# EAGLE design Moisture_8266 (EAGLE 6.6.0)
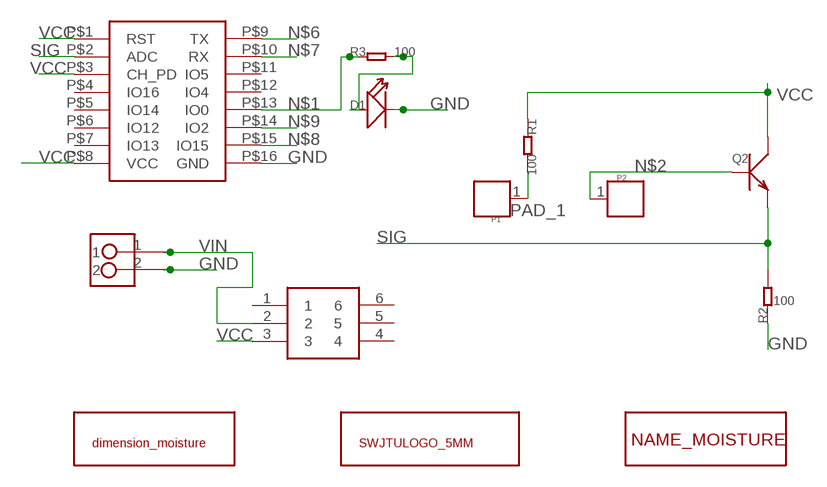
[diagram p0: schematic, sheet 1]

## Parts
D1  LED0603  [LED-0603]
P1  PAD.03  [1P-SMD-0.76X0.76]
P2  PAD.03  [1P-SMD-0.76X0.76]
Q2  TRANSISTOR-NPN-SOT23''  [SOT23]
R1  100  R-0603  [0603]
R2  100  R-0603  [0603]
R3  100  R-0603  [R0603]
U$1  MSS-22C02  [MSS-22C02]
U$2  SWJTULOGO  [SWJTULOGO10*10MM]
U$4  NAME_MOISTURE  [NAME_MOISTURE]
U$5  HEAD_8266_07  [HEAD_8266_07]
U$6  POWER_3.6V  [POWER_3.6V]
U$7  DIMENSION_MOISTURE_LONG  [MOISTURE_LONG]

## Nets
GND: D1.- R2.1 U$5.P$16(GND) U$6.2
N$1: R3.1 U$5.P$13(IO0)
N$2: P2.1 Q2.1(B)
N$6: U$5.P$9(TX)
N$7: U$5.P$10(RX)
N$8: U$5.P$15(IO15)
N$9: U$5.P$14(IO2)
N$10: D1.+ R3.2
PAD_1: P1.1 R1.2
SIG: Q2.2(E) R2.2 U$5.P$2(ADC)
VCC: Q2.3(C) R1.1 U$1.3 U$5.P$1(RST) U$5.P$3(CH_PD) U$5.P$8(VCC)
VIN: U$1.2 U$6.1
Unconnected: U$1.1 U$1.4 U$1.5 U$1.6 U$5.P$4(IO16) U$5.P$5(IO14) U$5.P$6(IO12) U$5.P$7(IO13) U$5.P$11(IO5) U$5.P$12(IO4)

## Library data of the parts
D1 = Xmaker:LED*
P1 P2 = Discrete:PAD
Q2 = Discrete:TRANSISTOR-NPN*: NPN audion
R1 R2 = Discrete:R*
R3 = Xmaker:R*
U$1 = Xmaker:MSS-22C02
U$2 = Xmaker:SWJTULOGO
U$4 = Xmaker:NAME_MOISTURE
U$5 = Xmaker:HEAD_8266_07
U$6 = Xmaker:POWER_3.6V
U$7 = Xmaker:DIMENSION_MOISTURE_LONG

## Board
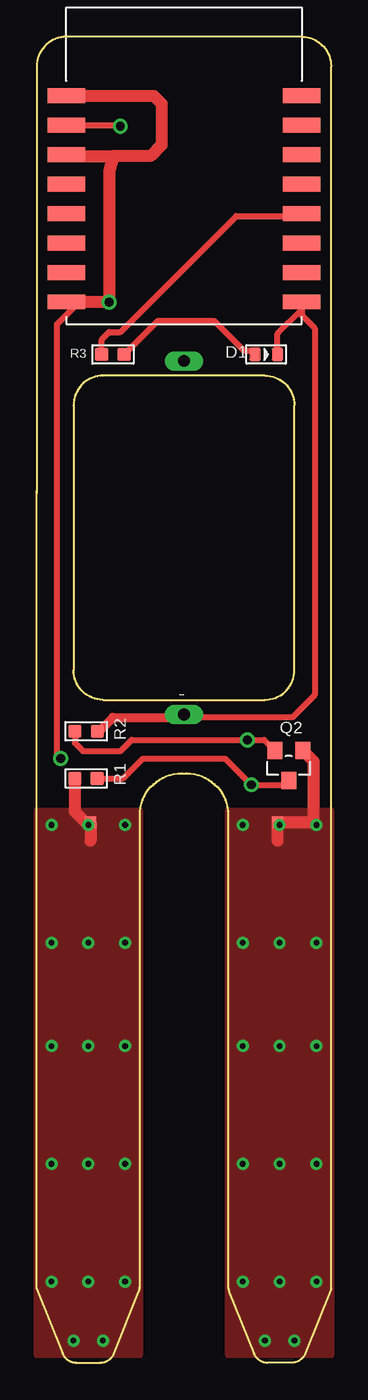
[diagram p1: board, top side]
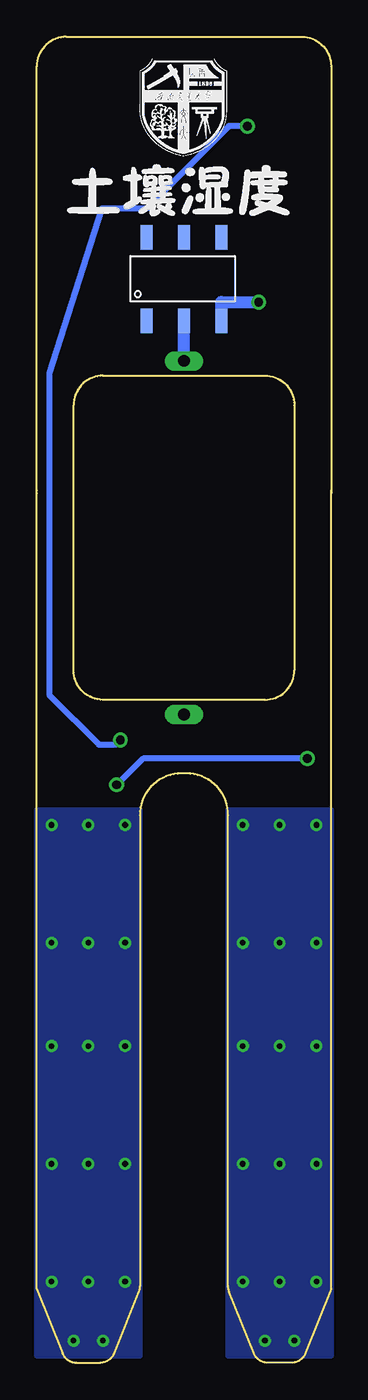
[diagram p2: board, bottom side, seen from below]

Size 20 x 90 mm. Coordinates in mm from the lower left corner, seen from the top.
Copper layers (1*16): Top 0.035mm / dielectric 1.5mm / Bottom 0.035mm
Design rules "default": minimum track width 10mil, minimum drill 12mil, track to track 8mil, track to pad 8mil, pad to pad 8mil, via to via 8mil, smd to smd 8mil, copper to edge 0mil, drill to drill 8mil, minimum pad ring 10mil, minimum via ring 8mil, stop-mask expansion 4mil, vias tented up to drill 25mil, thermal gap 10mil

### Footprints (pad centres in the part's own frame; a part is rotated, then mirrored left to right if it is on the bottom)
LED-0603 = smd 0.762 x 0.889: + -0.762,0; - 0.762,0
1P-SMD-0.76X0.76 = smd 0.762 x 0.762: 1 0,0
SOT23 = smd 1.016 x 1.143: 1 -0.95,-1.016; 2 0.95,-1.016; 3 0,1.016
0603 = smd 0.889 x 0.889: 1 -0.762,0; 2 0.762,0
R0603 = smd 0.889 x 0.889: 1 -0.762,0; 2 0.762,0
MSS-22C02 = smd 1.676 x 0.813: 1 0,0; 2 0,-2.54; 3 0,-5.08; 4 5.65,-5.08; 5 5.65,-2.54; 6 5.65,0
HEAD_8266_07 = smd 2.54 x 1: P$1 0,0; P$2 0,-2; P$3 0,-4; P$4 0,-6; P$5 0,-8; P$6 0,-10; P$7 0,-12; P$8 0,-14; P$9 16,0; P$10 16,-2; P$11 16,-4; P$12 16,-6; P$13 16,-8; P$14 16,-10; P$15 16,-12; P$16 16,-14
POWER_3.6V = drill 0.8 long: 1 7.5,23; 2 7.5,-1

### Placement (x,y rotation side)
D1  15.59,68.44 0 top
P1  3.65,36.69 0 top
P2  16.35,36.69 0 top
Q2  17.11,40.55 180 top
R1  3.35,39.66 180 top
R2  3.36,42.86 180 top
R3  5.17,68.44 0 top
U$1  12.54,70.73 90 bottom
U$2  10,85.97 0 bottom
U$4  10.4,77.5 0 bottom
U$5  2,86 0 top
U$6  2.5,45 0 top
U$7  0,0 0 top

### Tracks (layer width: path | path; a pad name or v marks a point on that pad's centre or on a via)
GND
  Top 0.406: U$5.P$16 18,71.49 | 18,71.49 18,71.11 18.89,70.22 18.89,45.33 17.37,43.8 10.2,43.8 U$6.2 | D1.- 16.35,69.84 18,71.49
  Top 0.61: R2.1 4.23,42.86 5.17,43.8 9.8,43.8 U$6.2
N$1
  Top 0.406: R3.1 4.41,69.46 4.92,69.96 5.68,69.96 13.56,77.84 17.84,77.84 U$5.P$13
N$2  (via drill 0.38 pad 0.81)
  Top 0.813: 16.35,35.42 P2.1 18.81,36.69 | 18.81,36.69 v19,36.5 | 18.81,36.69 18.81,40.82 Q2.1
  other vias: 15.5,1.5 17.5,1.5 14,5.5 16.5,5.5 19,5.5 14,36.5 16.5,36.5 14,28.5 16.5,28.5 19,28.5 14,21.5 16.5,21.5 19,21.5 14,13.5 16.5,13.5 19,13.5
  pour Top (isolate 0.406, no thermals): 13,37.5 20,37.5 20,0.5 13,0.5
  pour Bottom (isolate 0.406, no thermals): 13,37.5 20,37.5 20,0.5 13,0.5
N$10
  Top 0.406: R3.2 8.22,70.73 12.03,70.73 14.06,68.69 14.57,68.69 D1.+
PAD_1  (via drill 0.38 pad 0.81)
  Top 0.813: P1.1 3.65,35.42 | R1.2 2.59,37.41 v3.5,36.5
  other vias: 2.5,1.5 4.5,1.5 1,36.5 6,36.5 3.5,28.5 6,28.5 6,21.5 3.5,21.5 1,5.5 1,13.5 1,21.5 1,28.5 3.5,13.5 6,13.5 3.5,5.5 6,5.5
  pour Top (isolate 0.406, no thermals): 0,37.5 7,37.5 7,0.5 0,0.5
  pour Bottom (isolate 0.406, no thermals): 0,37.5 7,37.5 7,0.5 0,0.5
SIG  (via drill 0.6)
  Top 0.406: R2.2 2.59,42.06 3.14,41.52 5.68,41.52 6.44,42.28 v14.32,42.28 15.45,42.28 Q2.2 | U$5.P$2 5.62,84 v5.68,83.93
  Bottom 0.406: v5.68,83.93 6.95,83.93 12.54,78.35 15.59,78.35 19.14,67.17 19.14,45.33 15.77,41.95 14.64,41.95 v14.32,42.28
VCC  (via drill 0.6)
  Top 0.406: v1.62,41.01 1.36,41.26 1.36,70.47 2.95,72.06 | Q2.3 16.81,39.23 v14.57,39.23 12.79,41.01 7.21,41.01 5.86,39.66 R1.1
  Top 0.813: U$5.P$1 7.93,86 8.48,85.46 8.48,82.66 7.71,81.9 5.17,81.9 | U$5.P$3 2.1,81.9 5.17,81.9 | U$5.P$8 2.95,72.06 2.77,72 v4.92,72 4.92,80.89 5.17,81.9
  Bottom 0.406: v1.62,41.01 12.79,41.01 v14.57,39.23
  Bottom 0.813: U$1.3 7.46,72 v4.92,72
VIN
  Bottom 0.813: U$6.1 U$1.2